# Altium schematic sheet AVR Board 4.0 FTDI USB.SchDoc
size B
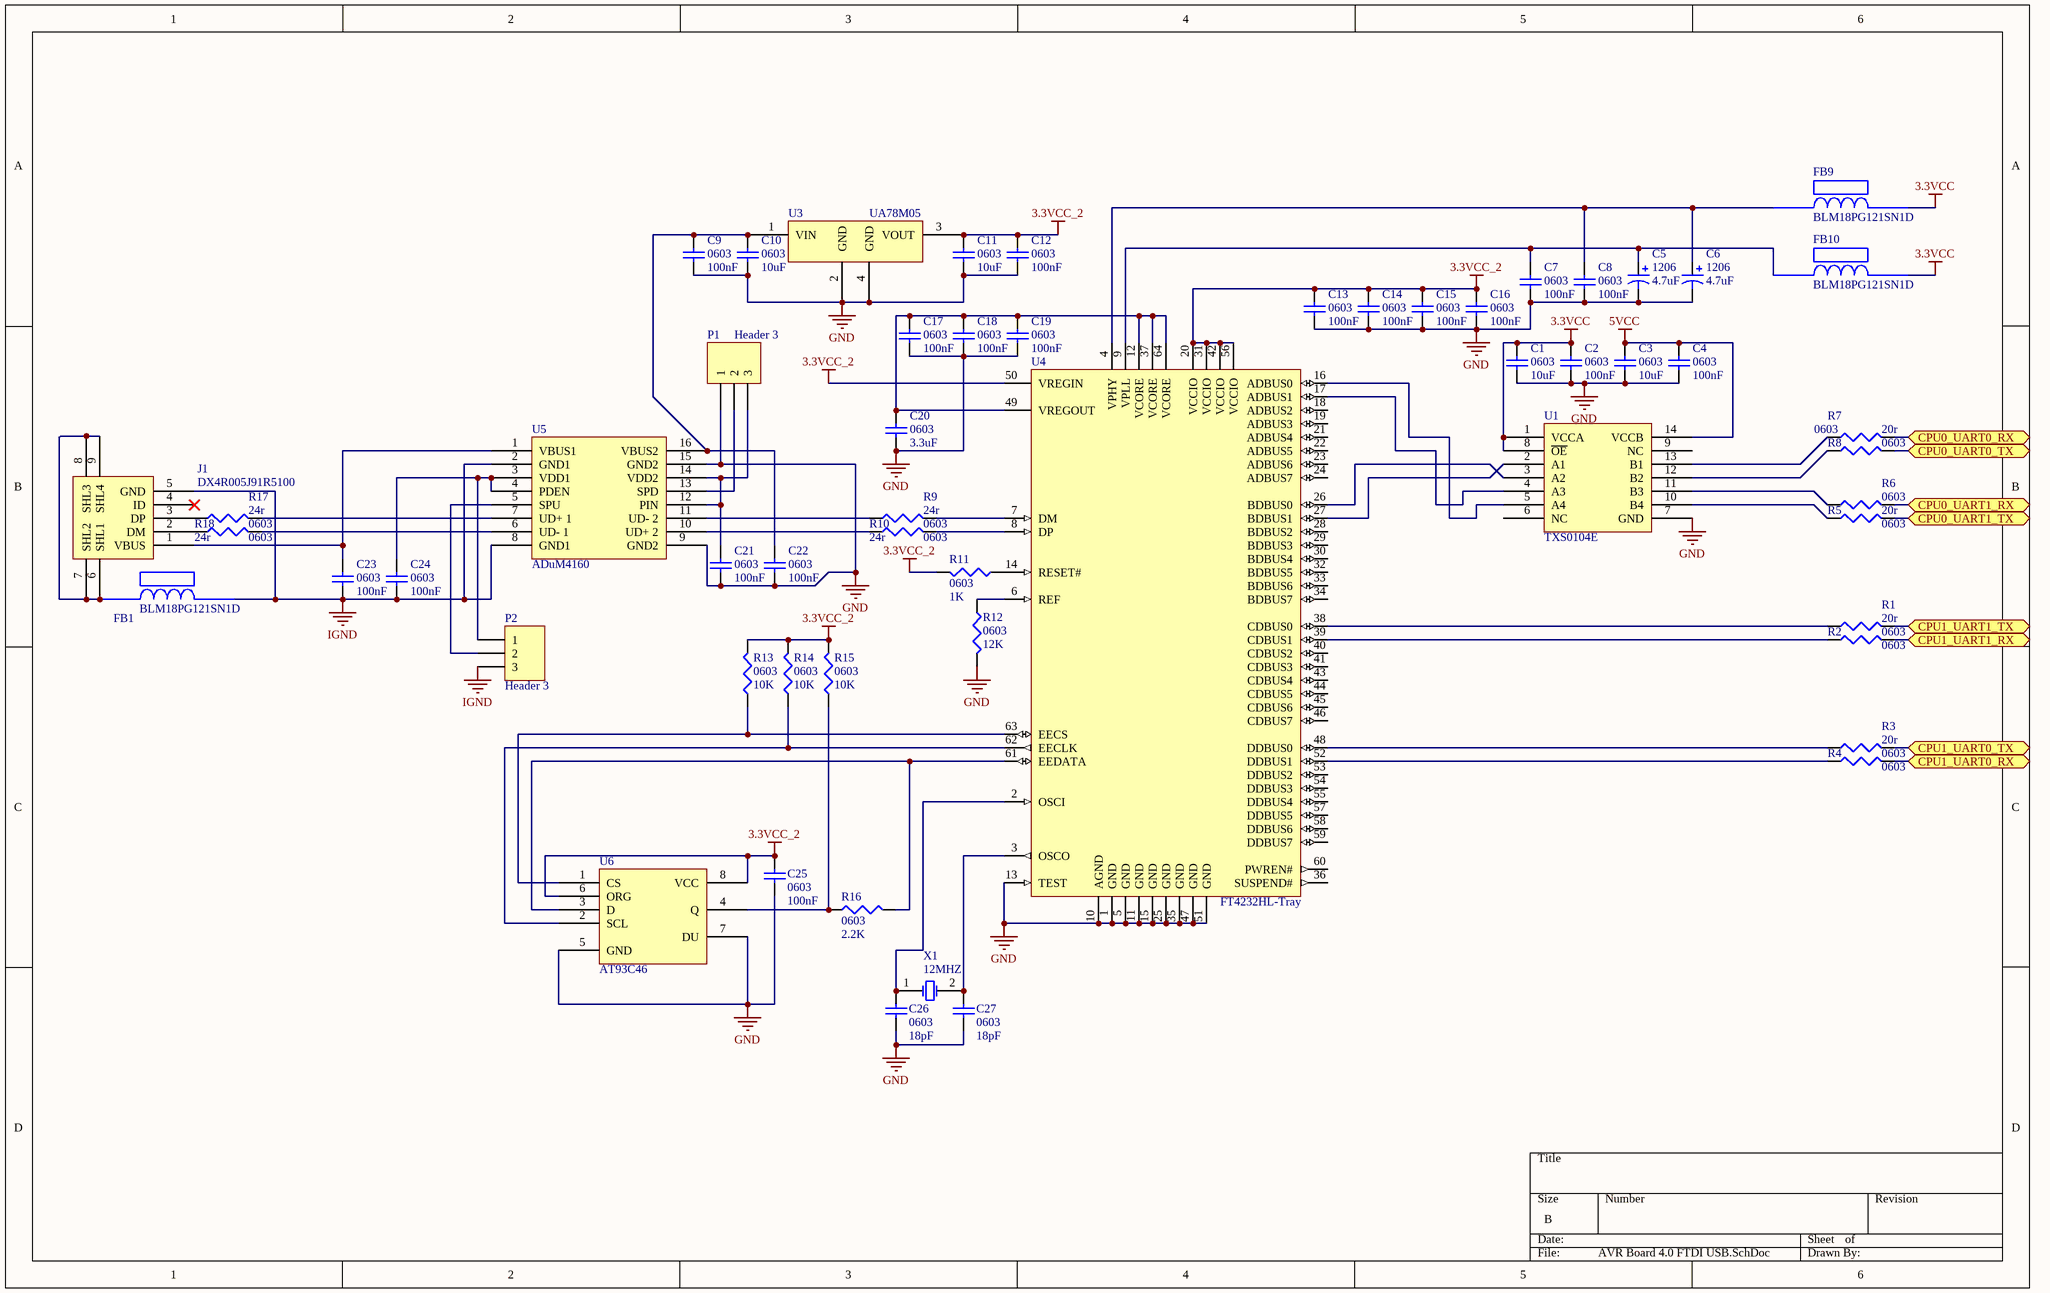
[diagram p0: AVR Board 4.0 FTDI USB.SchDoc]

## Parts
C1  0603  value 10uF  [1608[0603]]
C2  0603  value 100nF  [1608[0603]]
C3  0603  value 10uF  [1608[0603]]
C4  0603  value 100nF  [1608[0603]]
C5  1206  value 4.7uF  [C1206POL]
C6  1206  value 4.7uF  [C1206POL]
C7  0603  value 100nF  [1608[0603]]
C8  0603  value 100nF  [1608[0603]]
C9  0603  value 100nF  [1608[0603]]
C10  0603  value 10uF  [1608[0603]]
C11  0603  value 10uF  [1608[0603]]
C12  0603  value 100nF  [1608[0603]]
C13  0603  value 100nF  [1608[0603]]
C14  0603  value 100nF  [1608[0603]]
C15  0603  value 100nF  [1608[0603]]
C16  0603  value 100nF  [1608[0603]]
C17  0603  value 100nF  [1608[0603]]
C18  0603  value 100nF  [1608[0603]]
C19  0603  value 100nF  [1608[0603]]
C20  0603  value 3.3uF  [1608[0603]]
C21  0603  value 100nF  [1608[0603]]
C22  0603  value 100nF  [1608[0603]]
C23  0603  value 100nF  [1608[0603]]
C24  0603  value 100nF  [1608[0603]]
C25  0603  value 100nF  [1608[0603]]
C26  0603  value 18pF  [1608[0603]]
C27  0603  value 18pF  [1608[0603]]
FB1  BLM18PG121SN1D  [BLM18PG121SN1D]
FB9  BLM18PG121SN1D  [BLM18PG121SN1D]
FB10  BLM18PG121SN1D  [BLM18PG121SN1D]
J1  DX4R005J91R5100  [Micro USB Circular Holes Only]
P1  Header 3  [HDR1X3]
P2  Header 3  [HDR1X3]
R1  0603  value 20r  [J1-0603]
R2  0603  [J1-0603]
R3  0603  value 20r  [J1-0603]
R4  0603  [J1-0603]
R5  0603  value 20r  [J1-0603]
R6  0603  [J1-0603]
R7  0603  value 20r  [J1-0603]
R8  0603  [J1-0603]
R9  0603  value 24r  [J1-0603]
R10  0603  value 24r  [J1-0603]
R11  0603  value 1K  [J1-0603]
R12  0603  value 12K  [J1-0603]
R13  0603  value 10K  [J1-0603]
R14  0603  value 10K  [J1-0603]
R15  0603  value 10K  [J1-0603]
R16  0603  value 2.2K  [J1-0603]
R17  0603  value 24r  [J1-0603]
R18  0603  value 24r  [J1-0603]
U1  TXS0104E  [SOIC127P600X175-14N]
U3  UA78M05  [SOT230P700X180-4N]
U4  FT4232HL-Tray  [LQFP-64_N]
U5  ADuM4160  [ADuM4160]
U6  AT93C46  [SOIC127P600X175-8N]
X1  12MHZ  [445C35A12M00000]

## Ports
CPU0_UART0_RX, CPU0_UART0_TX, CPU0_UART1_RX, CPU0_UART1_TX, CPU1_UART0_RX, CPU1_UART0_TX, CPU1_UART1_RX, CPU1_UART1_TX

## Nets
3.3VCC: C1.2 C2.2 FB9.2 FB10.2 U1.1(VCCA) U1.8(~{OE})
3.3VCC_2: C11.2 C12.2 C13.2 C14.2 C15.2 C16.2 C25.2 R11.2 R13.2 R14.2 R15.2 U3.3(VOUT) U4.20(VCCIO) U4.31(VCCIO) U4.42(VCCIO) U4.50(VREGIN) U4.56(VCCIO) U6.6(ORG) U6.8(VCC)
5VCC: C3.2 C4.2 U1.14(VCCB)
GND: C1.1 C2.1 C3.1 C4.1 C5.2 C6.2 C7.1 C8.1 C9.1 C10.1 C11.1 C12.1 C13.1 C14.1 C15.1 C16.1 C17.1 C18.1 C19.1 C20.1 C21.1 C22.1 C25.1 C26.1 C27.1 P1.1 R12.2 U1.7(GND) U3.2(GND) U3.4(GND) U4.1(GND) U4.5(GND) U4.10(AGND) U4.11(GND) U4.13(TEST) U4.15(GND) U4.25(GND) U4.35(GND) U4.47(GND) U4.51(GND) U5.9(GND2) U5.15(GND2) U6.5(GND) U6.7(DU)
IGND: C23.1 C24.1 FB1.2 J1.5(GND) P2.3 U5.2(GND1) U5.8(GND1)
CPU0_UART0_RX: R7.2 ; port CPU0_UART0_RX
CPU0_UART0_TX: R8.2 ; port CPU0_UART0_TX
CPU0_UART1_RX: R6.2 ; port CPU0_UART1_RX
CPU0_UART1_TX: R5.2 ; port CPU0_UART1_TX
CPU1_UART0_RX: R4.2 ; port CPU1_UART0_RX
CPU1_UART0_TX: R3.2 ; port CPU1_UART0_TX
CPU1_UART1_RX: R2.2 ; port CPU1_UART1_RX
CPU1_UART1_TX: R1.2 ; port CPU1_UART1_TX
NetC5_1: C5.1 C7.2 FB10.1 U4.9(VPLL)
NetC6_1: C6.1 C8.2 FB9.1 U4.4(VPHY)
NetC9_2: C9.2 C10.2 C22.2 U3.1(VIN) U5.16(VBUS2)
NetC17_2: C17.2 C18.2 C19.2 C20.2 U4.12(VCORE) U4.37(VCORE) U4.49(VREGOUT) U4.64(VCORE)
NetC21_2: C21.2 P1.3 U5.12(PIN) U5.14(VDD2)
NetC23_2: C23.2 J1.1(VBUS) U5.1(VBUS1)
NetC24_2: C24.2 P2.1 U5.3(VDD1) U5.4(PDEN)
NetC26_2: C26.2 U4.2(OSCI) X1.1(OSC1)
NetC27_2: C27.2 U4.3(OSCO) X1.2(OSC2)
NetFB1_1: FB1.1 J1.6(SHL1) J1.7(SHL2) J1.8(SHL3) J1.9(SHL4)
NetJ1_2: J1.2(DM) R18.1
NetJ1_3: J1.3(DP) R17.1
NetP1_2: P1.2 U5.13(SPD)
NetP2_2: P2.2 U5.5(SPU)
NetR1_1: R1.1 U4.38(CDBUS0)
NetR2_1: R2.1 U4.39(CDBUS1)
NetR3_1: R3.1 U4.48(DDBUS0)
NetR4_1: R4.1 U4.52(DDBUS1)
NetR5_1: R5.1 U1.10(B4)
NetR6_1: R6.1 U1.11(B3)
NetR7_1: R7.1 U1.13(B1)
NetR8_1: R8.1 U1.12(B2)
NetR9_1: R9.1 U5.11(UD-_2)
NetR9_2: R9.2 U4.7(DM)
NetR10_1: R10.1 U5.10(UD+_2)
NetR10_2: R10.2 U4.8(DP)
NetR11_1: R11.1 U4.14(RESET#)
NetR12_1: R12.1 U4.6(REF)
NetR13_1: R13.1 U4.63(EECS) U6.1(CS)
NetR14_1: R14.1 U4.62(EECLK) U6.2(SCL)
NetR15_1: R15.1 R16.1 U6.4(Q)
NetR16_2: R16.2 U4.61(EEDATA) U6.3(D)
NetR17_2: R17.2 U5.7(UD+_1)
NetR18_2: R18.2 U5.6(UD-_1)
NetU1_2: U1.2(A1) U4.27(BDBUS1)
NetU1_3: U1.3(A2) U4.26(BDBUS0)
NetU1_4: U1.4(A3) U4.17(ADBUS1)
NetU1_5: U1.5(A4) U4.16(ADBUS0)

Not connected (* = marked no-connect by the designer): J1 4(ID)*; U1 6(NC) 9(NC); U4 18(ADBUS2) 19(ADBUS3) 21(ADBUS4) 22(ADBUS5) 23(ADBUS6) 24(ADBUS7) 28(BDBUS2) 29(BDBUS3) 30(BDBUS4) 32(BDBUS5) 33(BDBUS6) 34(BDBUS7) 36(SUSPEND#) 40(CDBUS2) 41(CDBUS3) 43(CDBUS4) 44(CDBUS5) 45(CDBUS6) 46(CDBUS7) 53(DDBUS2) 54(DDBUS3) 55(DDBUS4) 57(DDBUS5) 58(DDBUS6) 59(DDBUS7) 60(PWREN#)

## Library data of the parts
C1-C4 C7-C27 = Cap Semi: Capacitor (Semiconductor SIM Model); Published: 8-Jun-2000; LatestRevisionDate: 29-May-2009; LatestRevisionNote: IPC-7351 Footprint Added.; PackageReference: C1206; Publisher: Altium Limited; PackageDescription: Chip Capacitor
C5 C6 = Cap Pol3: Polarized Capacitor (Surface Mount); Published: 8-Jun-2000; LatestRevisionDate: 29-May-2009; LatestRevisionNote: IPC-7351 Footprint Added.; PackageReference: C0805; Publisher: Altium Limited; PackageDescription: Chip Capacitor
J1 = Micro USB: Micro USB Jack B
P1 P2 = Header 3: Header, 3-Pin; LatestRevisionDate: 17-Jul-2002; LatestRevisionNote: Re-released for DXP Platform.; Publisher: Altium Limited
R1-R18 = Res3: Resistor; Published: 8-Jun-2000; LatestRevisionDate: 29-May-2009; LatestRevisionNote: IPC-7351 Footprint Added.; PackageReference: J1-0603; Publisher: Altium Limited; PackageDescription: Chip Resistor
U4 = FT4232HL-Tray: Quad High Speed USB To Multipurpose UART/MPSSE IC, 64-pin LQFP, Tray; Manufacturer: FTDI; DatasheetVersion: ver 2.2, Jan-2012; PackageVersion: Jan-12; PackageReference: LQFP-64; PackageDescription: 64-Pin Thin Quad Flat Pack, 10 x 10 x 1.4 mm Body, 0.5 mm Pitch; PartNumber: FT4232HL-Tray; ComponentLink1Description: Manufacturer URL; ComponentLink1URL: http://www.ftdichip.com/; ComponentLink2Description: Datasheet; ComponentLink2URL: http://www.ftdichip.com/Support/Documents/DataSheets/ICs/DS_FT4232H.pdf
U5 = ADuM4160: USB Opto Isolator
X1 = XTAL: Crystal Oscillator; Published: 8-Jun-2000; LatestRevisionDate: 17-Jul-2002; LatestRevisionNote: Re-released for DXP Platform.; PackageReference: R38; Publisher: Altium Limited; PackageDescription: Crystal, Thru-Hole; 2 Leads; Body 3.1 x 8.2 mm (Dia.xH)